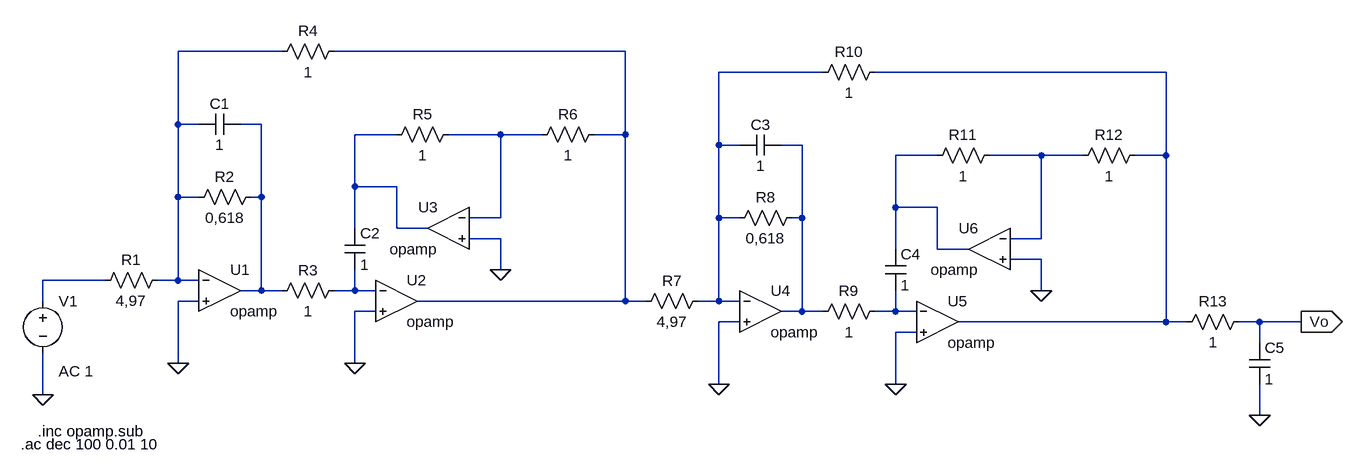
[diagram p0: schematic Draft2.asc]
Draft2.asc, the LTspice schematic file:
Version 4
SHEET 1 1820 680
WIRE 160 -176 0 -176
WIRE 688 -176 240 -176
WIRE 992 -144 832 -144
WIRE 1520 -144 1072 -144
WIRE 0 -64 0 -176
WIRE 32 -64 0 -64
WIRE 128 -64 96 -64
WIRE 336 -48 272 -48
WIRE 496 -48 416 -48
WIRE 560 -48 496 -48
WIRE 688 -48 688 -176
WIRE 688 -48 640 -48
WIRE 832 -32 832 -144
WIRE 864 -32 832 -32
WIRE 960 -32 928 -32
WIRE 1168 -16 1104 -16
WIRE 1328 -16 1248 -16
WIRE 1392 -16 1328 -16
WIRE 1520 -16 1520 -144
WIRE 1520 -16 1472 -16
WIRE 272 32 272 -48
WIRE 336 32 272 32
WIRE 0 48 0 -64
WIRE 32 48 0 48
WIRE 128 48 128 -64
WIRE 128 48 112 48
WIRE 1104 64 1104 -16
WIRE 1168 64 1104 64
WIRE 496 80 496 -48
WIRE 496 80 448 80
WIRE 832 80 832 -32
WIRE 864 80 832 80
WIRE 960 80 960 -32
WIRE 960 80 944 80
WIRE 272 96 272 32
WIRE 336 96 336 32
WIRE 384 96 336 96
WIRE 496 112 448 112
WIRE 1328 112 1328 -16
WIRE 1328 112 1280 112
WIRE 1104 128 1104 64
WIRE 1168 128 1168 64
WIRE 1216 128 1168 128
WIRE 1328 144 1280 144
WIRE 496 160 496 112
WIRE -112 176 -208 176
WIRE 0 176 0 48
WIRE 0 176 -32 176
WIRE 32 176 0 176
WIRE 128 192 128 48
WIRE 128 192 96 192
WIRE 160 192 128 192
WIRE 272 192 272 160
WIRE 272 192 240 192
WIRE 304 192 272 192
WIRE 1328 192 1328 144
WIRE -208 208 -208 176
WIRE 32 208 0 208
WIRE 688 208 688 -48
WIRE 688 208 368 208
WIRE 720 208 688 208
WIRE 832 208 832 80
WIRE 832 208 800 208
WIRE 864 208 832 208
WIRE 304 224 272 224
WIRE 960 224 960 80
WIRE 960 224 928 224
WIRE 992 224 960 224
WIRE 1104 224 1104 192
WIRE 1104 224 1072 224
WIRE 1136 224 1104 224
WIRE 864 240 832 240
WIRE 1520 240 1520 -16
WIRE 1520 240 1200 240
WIRE 1552 240 1520 240
WIRE 1664 240 1632 240
WIRE 1728 240 1664 240
WIRE 1136 256 1104 256
WIRE 1664 272 1664 240
WIRE 0 304 0 208
WIRE 272 304 272 224
WIRE 832 336 832 240
WIRE 1104 336 1104 256
WIRE -208 352 -208 288
WIRE 1664 384 1664 336
FLAG 0 304 0
FLAG 272 304 0
FLAG 496 160 0
FLAG -208 352 0
FLAG 832 336 0
FLAG 1104 336 0
FLAG 1328 192 0
FLAG 1664 384 0
FLAG 1728 240 Vo
IOPIN 1728 240 Out
SYMBOL OpAmps\\opamp 64 128 R0
SYMATTR InstName U1
SYMBOL OpAmps\\opamp 336 144 R0
SYMATTR InstName U2
SYMBOL OpAmps\\opamp 416 32 M0
SYMATTR InstName U3
SYMBOL res -16 160 R90
WINDOW 0 0 56 VBottom 2
WINDOW 3 32 56 VTop 2
SYMATTR InstName R1
SYMATTR Value 4,97
SYMBOL res 128 32 R90
WINDOW 0 0 56 VBottom 2
WINDOW 3 32 56 VTop 2
SYMATTR InstName R2
SYMATTR Value 0,618
SYMBOL res 256 176 R90
WINDOW 0 0 56 VBottom 2
WINDOW 3 32 56 VTop 2
SYMATTR InstName R3
SYMATTR Value 1
SYMBOL res 256 -192 R90
WINDOW 0 0 56 VBottom 2
WINDOW 3 32 56 VTop 2
SYMATTR InstName R4
SYMATTR Value 1
SYMBOL res 432 -64 R90
WINDOW 0 0 56 VBottom 2
WINDOW 3 32 56 VTop 2
SYMATTR InstName R5
SYMATTR Value 1
SYMBOL res 656 -64 R90
WINDOW 0 0 56 VBottom 2
WINDOW 3 32 56 VTop 2
SYMATTR InstName R6
SYMATTR Value 1
SYMBOL cap 96 -80 R90
WINDOW 0 0 32 VBottom 2
WINDOW 3 32 32 VTop 2
SYMATTR InstName C1
SYMATTR Value 1
SYMBOL cap 256 96 R0
SYMATTR InstName C2
SYMATTR Value 1
SYMBOL voltage -208 192 R0
WINDOW 123 24 124 Left 2
WINDOW 39 0 0 Left 0
SYMATTR InstName V1
SYMATTR Value ""
SYMATTR Value2 AC 1
SYMBOL OpAmps\\opamp 896 160 R0
SYMATTR InstName U4
SYMBOL OpAmps\\opamp 1168 176 R0
SYMATTR InstName U5
SYMBOL OpAmps\\opamp 1248 64 M0
SYMATTR InstName U6
SYMBOL res 816 192 R90
WINDOW 0 0 56 VBottom 2
WINDOW 3 32 56 VTop 2
SYMATTR InstName R7
SYMATTR Value 4,97
SYMBOL res 960 64 R90
WINDOW 0 0 56 VBottom 2
WINDOW 3 32 56 VTop 2
SYMATTR InstName R8
SYMATTR Value 0,618
SYMBOL res 1088 208 R90
WINDOW 0 0 56 VBottom 2
WINDOW 3 32 56 VTop 2
SYMATTR InstName R9
SYMATTR Value 1
SYMBOL res 1088 -160 R90
WINDOW 0 0 56 VBottom 2
WINDOW 3 32 56 VTop 2
SYMATTR InstName R10
SYMATTR Value 1
SYMBOL res 1264 -32 R90
WINDOW 0 0 56 VBottom 2
WINDOW 3 32 56 VTop 2
SYMATTR InstName R11
SYMATTR Value 1
SYMBOL res 1488 -32 R90
WINDOW 0 0 56 VBottom 2
WINDOW 3 32 56 VTop 2
SYMATTR InstName R12
SYMATTR Value 1
SYMBOL cap 928 -48 R90
WINDOW 0 0 32 VBottom 2
WINDOW 3 32 32 VTop 2
SYMATTR InstName C3
SYMATTR Value 1
SYMBOL cap 1088 128 R0
SYMATTR InstName C4
SYMATTR Value 1
SYMBOL res 1648 224 R90
WINDOW 0 0 56 VBottom 2
WINDOW 3 32 56 VTop 2
SYMATTR InstName R13
SYMATTR Value 1
SYMBOL cap 1648 272 R0
SYMATTR InstName C5
SYMATTR Value 1
TEXT -216 408 Left 2 !.inc opamp.sub
TEXT -242 428 Left 2 !.ac dec 100 0.01 10

The netlist it stands for:
* Draft2.asc
XU1 N001 0 N005 opamp Aol=100K GBW=10Meg  ; pins invin noninvin out
XU2 N012 0 N002 opamp Aol=100K GBW=10Meg  ; pins invin noninvin out
XU3 N007 0 N006 opamp Aol=100K GBW=10Meg  ; pins invin noninvin out
R1 N001 N011 4,97
R2 N005 N001 0,618
R3 N012 N005 1
R4 N002 N001 1
R5 N007 N006 1
R6 N002 N007 1
C1 N005 N001 1
C2 N006 N012 1
V1 N011 0 AC 1
XU4 N003 0 N008 opamp Aol=100K GBW=10Meg  ; pins invin noninvin out
XU5 N013 0 N004 opamp Aol=100K GBW=10Meg  ; pins invin noninvin out
XU6 N010 0 N009 opamp Aol=100K GBW=10Meg  ; pins invin noninvin out
R7 N003 N002 4,97
R8 N008 N003 0,618
R9 N013 N008 1
R10 N004 N003 1
R11 N010 N009 1
R12 N004 N010 1
C3 N008 N003 1
C4 N009 N013 1
R13 Vo N004 1
C5 Vo 0 1
.inc opamp.sub
.ac dec 100 0.01 10
.backanno
.end